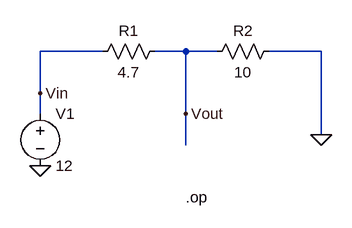
[diagram p0: schematic vd2.asc]
vd2.asc, the LTspice schematic file:
Version 4
SHEET 1 880 680
WIRE 304 240 208 240
WIRE 432 240 384 240
WIRE 480 240 432 240
WIRE 640 240 560 240
WIRE 208 304 208 240
WIRE 208 336 208 304
WIRE 432 336 432 240
WIRE 640 368 640 240
WIRE 432 384 432 336
FLAG 640 368 0
FLAG 208 416 0
FLAG 432 336 Vout
FLAG 208 304 Vin
SYMBOL voltage 208 320 R0
SYMATTR InstName V1
SYMATTR Value 12
SYMBOL Res 400 224 R90
WINDOW 0 0 56 VBottom 2
WINDOW 3 32 56 VTop 2
SYMATTR InstName R1
SYMATTR Value 4.7
SYMBOL Res 576 224 R90
WINDOW 0 0 56 VBottom 2
WINDOW 3 32 56 VTop 2
SYMATTR InstName R2
SYMATTR Value 10
TEXT 432 464 Left 2 !.op

The netlist it stands for:
* vd2.asc
V1 Vin 0 12
R1 Vout Vin 4.7
R2 0 Vout 10
.op
.backanno
.end